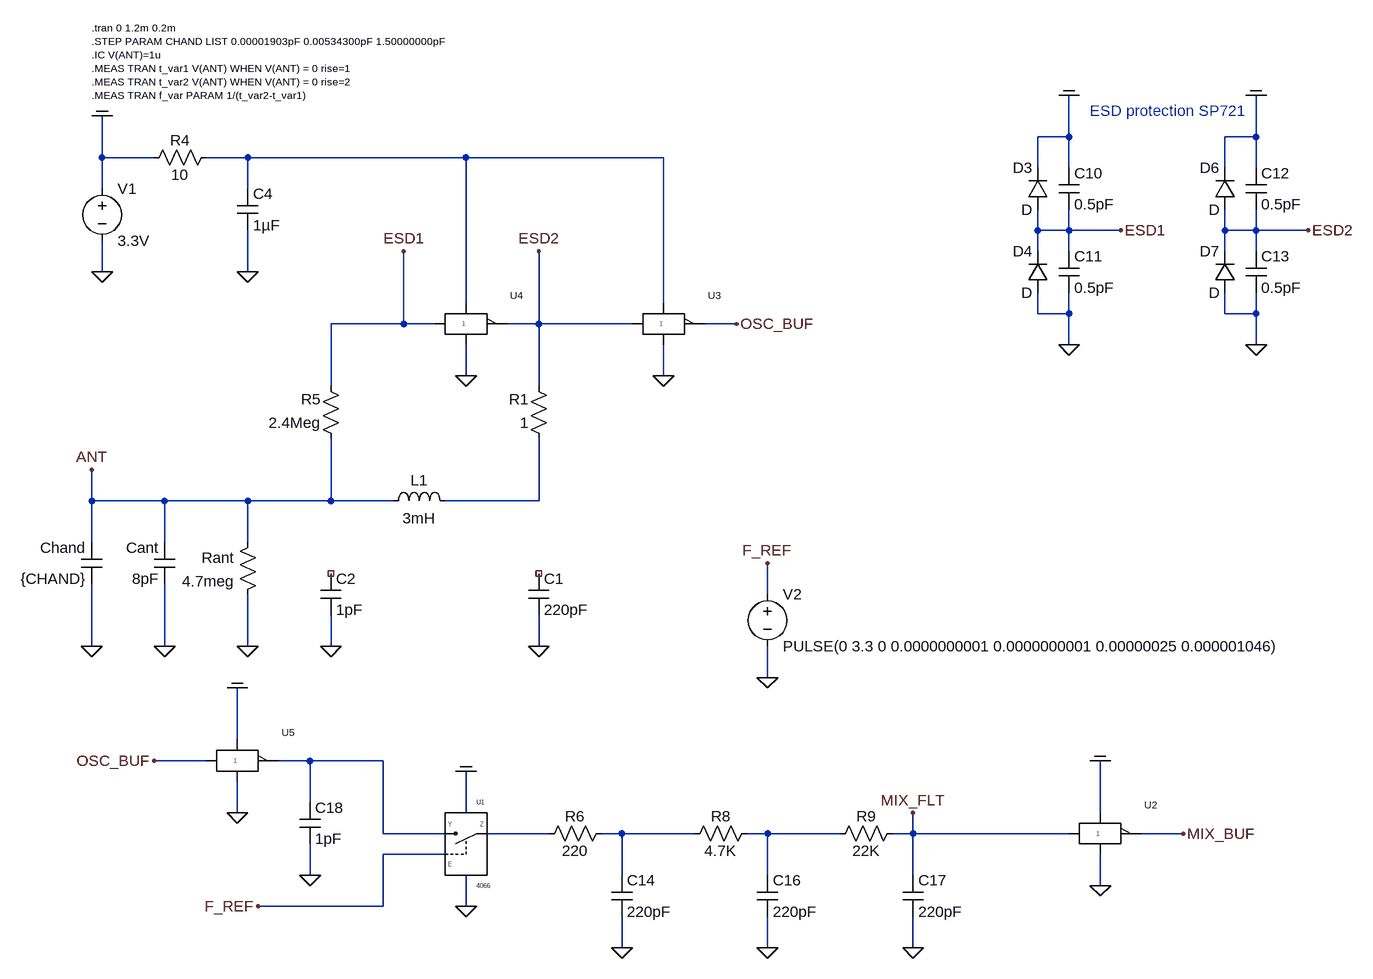
[diagram p0: schematic 2020_analog_oscill_sin_33v_v09_heter.asc]
2020_analog_oscill_sin_33v_v09_heter.asc, the LTspice schematic file:
Version 4
SHEET 1 2908 1572
WIRE 432 -368 432 -432
WIRE 432 -368 384 -368
WIRE 720 -368 720 -432
WIRE 720 -368 672 -368
WIRE -1056 -336 -1056 -400
WIRE -976 -336 -1056 -336
WIRE -832 -336 -896 -336
WIRE -496 -336 -832 -336
WIRE -192 -336 -496 -336
WIRE 384 -320 384 -368
WIRE 432 -320 432 -368
WIRE 672 -320 672 -368
WIRE 720 -320 720 -368
WIRE -1056 -288 -1056 -336
WIRE -832 -288 -832 -336
WIRE 384 -224 384 -256
WIRE 432 -224 432 -256
WIRE 432 -224 384 -224
WIRE 512 -224 432 -224
WIRE 672 -224 672 -256
WIRE 720 -224 720 -256
WIRE 720 -224 672 -224
WIRE 800 -224 720 -224
WIRE 384 -192 384 -224
WIRE 432 -192 432 -224
WIRE 672 -192 672 -224
WIRE 720 -192 720 -224
WIRE -1056 -160 -1056 -208
WIRE -832 -160 -832 -224
WIRE -496 -112 -496 -336
WIRE -192 -112 -192 -336
WIRE 384 -96 384 -128
WIRE 432 -96 432 -128
WIRE 432 -96 384 -96
WIRE 672 -96 672 -128
WIRE 720 -96 720 -128
WIRE 720 -96 672 -96
WIRE -592 -80 -592 -192
WIRE -592 -80 -704 -80
WIRE -544 -80 -592 -80
WIRE -384 -80 -384 -192
WIRE -384 -80 -432 -80
WIRE -240 -80 -384 -80
WIRE -80 -80 -128 -80
WIRE 432 -48 432 -96
WIRE 720 -48 720 -96
WIRE -496 0 -496 -48
WIRE -192 0 -192 -48
WIRE -704 16 -704 -80
WIRE -384 16 -384 -80
WIRE -1072 192 -1072 144
WIRE -960 192 -1072 192
WIRE -832 192 -960 192
WIRE -704 192 -704 96
WIRE -704 192 -832 192
WIRE -608 192 -704 192
WIRE -384 192 -384 96
WIRE -384 192 -528 192
WIRE -1072 256 -1072 192
WIRE -960 256 -960 192
WIRE -832 256 -832 192
WIRE -32 336 -32 288
WIRE -1072 416 -1072 320
WIRE -960 416 -960 320
WIRE -832 416 -832 336
WIRE -704 416 -704 368
WIRE -384 416 -384 368
WIRE -32 464 -32 416
WIRE -848 560 -848 480
WIRE -896 592 -976 592
WIRE -736 592 -784 592
WIRE -624 592 -736 592
WIRE -736 656 -736 592
WIRE -848 672 -848 624
WIRE -496 672 -496 608
WIRE 480 672 480 592
WIRE -624 704 -624 592
WIRE -528 704 -624 704
WIRE -368 704 -464 704
WIRE -256 704 -288 704
WIRE -144 704 -256 704
WIRE -32 704 -64 704
WIRE 80 704 -32 704
WIRE 192 704 192 672
WIRE 192 704 160 704
WIRE 432 704 192 704
WIRE 608 704 544 704
WIRE -528 736 -624 736
WIRE -736 768 -736 720
WIRE -256 768 -256 704
WIRE -32 768 -32 704
WIRE 192 768 192 704
WIRE 480 784 480 736
WIRE -624 816 -624 736
WIRE -624 816 -816 816
WIRE -496 816 -496 768
WIRE -256 880 -256 832
WIRE -32 880 -32 832
WIRE 192 880 192 832
FLAG -1056 -160 0
FLAG -1072 416 0
FLAG -1072 144 ANT
FLAG -832 416 0
FLAG -1056 -400 COM
FLAG 432 -48 0
FLAG 432 -432 COM
FLAG 512 -224 ESD1
FLAG 720 -48 0
FLAG 720 -432 COM
FLAG 800 -224 ESD2
FLAG -960 416 0
FLAG -592 -192 ESD1
FLAG -80 -80 OSC_BUF
FLAG -832 -160 0
FLAG -384 -192 ESD2
FLAG -976 592 OSC_BUF
FLAG -816 816 F_REF
FLAG -496 608 COM
FLAG -496 816 0
FLAG -256 880 0
FLAG -32 880 0
FLAG 192 880 0
FLAG 192 672 MIX_FLT
FLAG -32 464 0
FLAG -32 288 F_REF
FLAG -736 768 0
FLAG 480 592 COM
FLAG 480 784 0
FLAG 608 704 MIX_BUF
FLAG -192 0 0
FLAG -496 0 0
FLAG -384 416 0
FLAG -704 416 0
FLAG -848 480 COM
FLAG -848 672 0
SYMBOL voltage -1056 -304 R0
WINDOW 123 0 0 Left 2
WINDOW 39 0 0 Left 2
SYMATTR InstName V1
SYMATTR Value 3.3V
SYMBOL ind -512 208 M270
WINDOW 0 32 56 VTop 2
WINDOW 3 5 56 VBottom 2
SYMATTR InstName L1
SYMATTR Value 3mH
SYMATTR SpiceLine Ipk=0.1 Rser=101 Rpar=2Meg Cpar=1.286pF
SYMBOL cap -1056 256 M0
SYMATTR InstName Chand
SYMATTR Value {CHAND}
SYMBOL res -816 240 M0
SYMATTR InstName Rant
SYMATTR Value 4.7meg
SYMBOL diode 400 -256 R180
WINDOW 0 24 64 Left 2
WINDOW 3 24 0 Left 2
SYMATTR InstName D3
SYMBOL diode 400 -128 R180
WINDOW 0 24 64 Left 2
WINDOW 3 24 0 Left 2
SYMATTR InstName D4
SYMBOL cap 416 -320 R0
SYMATTR InstName C10
SYMATTR Value 0.5pF
SYMBOL cap 416 -192 R0
SYMATTR InstName C11
SYMATTR Value 0.5pF
SYMBOL diode 688 -256 R180
WINDOW 0 24 64 Left 2
WINDOW 3 24 0 Left 2
SYMATTR InstName D6
SYMBOL diode 688 -128 R180
WINDOW 0 24 64 Left 2
WINDOW 3 24 0 Left 2
SYMATTR InstName D7
SYMBOL cap 704 -320 R0
SYMATTR InstName C12
SYMATTR Value 0.5pF
SYMBOL cap 704 -192 R0
SYMATTR InstName C13
SYMATTR Value 0.5pF
SYMBOL cap -944 256 M0
SYMATTR InstName Cant
SYMATTR Value 8pF
SYMBOL res -880 -352 R90
WINDOW 0 5 56 VBottom 2
WINDOW 3 27 56 VTop 2
SYMATTR InstName R4
SYMATTR Value 10
SYMBOL cap -848 -288 R0
SYMATTR InstName C4
SYMATTR Value 1µF
SYMBOL Dig_Add\\CD4xxx\\cd4066 -496 720 R0
SYMATTR InstName U1
SYMBOL cap -272 768 R0
SYMATTR InstName C14
SYMATTR Value 220pF
SYMBOL res -272 688 R90
WINDOW 0 5 56 VBottom 2
WINDOW 3 27 56 VTop 2
SYMATTR InstName R6
SYMATTR Value 220
SYMBOL cap -48 768 R0
SYMATTR InstName C16
SYMATTR Value 220pF
SYMBOL res -48 688 R90
WINDOW 0 5 56 VBottom 2
WINDOW 3 27 56 VTop 2
SYMATTR InstName R8
SYMATTR Value 4.7K
SYMBOL cap 176 768 R0
SYMATTR InstName C17
SYMATTR Value 220pF
SYMBOL res 176 688 R90
WINDOW 0 5 56 VBottom 2
WINDOW 3 27 56 VTop 2
SYMATTR InstName R9
SYMATTR Value 22K
SYMBOL voltage -32 320 R0
WINDOW 123 0 0 Left 2
WINDOW 39 0 0 Left 2
SYMATTR InstName V2
SYMATTR Value PULSE(0 3.3 0 0.0000000001 0.0000000001 0.00000025 0.000001046)
SYMBOL cap -752 656 R0
SYMATTR InstName C18
SYMATTR Value 1pF
SYMBOL SBORKA\\Logika\\74AHC1G04 480 656 R0
SYMATTR InstName U2
SYMBOL SBORKA\\Logika\\74AHC1G04 -192 -128 R0
SYMATTR InstName U3
SYMBOL SBORKA\\Logika\\74AHC1G04 -496 -128 R0
SYMATTR InstName U4
SYMBOL cap -400 304 R0
SYMATTR InstName C1
SYMATTR Value 220pF
SYMBOL res -688 112 R180
WINDOW 0 31 76 Left 2
WINDOW 3 31 40 Left 2
SYMATTR InstName R5
SYMATTR Value 2.4Meg
SYMBOL res -368 112 R180
WINDOW 0 31 76 Left 2
WINDOW 3 31 40 Left 2
SYMATTR InstName R1
SYMATTR Value 1
SYMBOL cap -720 304 R0
SYMATTR InstName C2
SYMATTR Value 1pF
SYMBOL SBORKA\\Logika\\74AHC1G04 -848 544 R0
SYMATTR InstName U5
TEXT -1072 -536 Left 1 !.tran 0 1.2m 0.2m\n.STEP PARAM CHAND LIST 0.00001903pF 0.00534300pF 1.50000000pF\n.IC V(ANT)=1u\n.MEAS TRAN t_var1 V(ANT) WHEN V(ANT) = 0 rise=1\n.MEAS TRAN t_var2 V(ANT) WHEN V(ANT) = 0 rise=2\n.MEAS TRAN f_var PARAM 1/(t_var2-t_var1)
TEXT 464 -408 Left 2 ;ESD protection SP721

The netlist it stands for:
* 2020_analog_oscill_sin_33v_v09_heter.asc
V1 COM 0 3.3V
L1 N002 ANT 3mH Ipk=0.1 Rser=101 Rpar=2Meg Cpar=1.286pF
Chand ANT 0 {CHAND}
Rant ANT 0 4.7meg
D3 ESD1 COM D
D4 0 ESD1 D
C10 COM ESD1 0.5pF
C11 ESD1 0 0.5pF
D6 ESD2 COM D
D7 0 ESD2 D
C12 COM ESD2 0.5pF
C13 ESD2 0 0.5pF
Cant ANT 0 8pF
R4 N001 COM 10
C4 N001 0 1µF
XU1 N003 N004 F_REF COM 0 4066  ; pins Y OUT EN VCC VSS
C14 N005 0 220pF
R6 N005 N004 220
C16 N006 0 220pF
R8 N006 N005 4.7K
C17 MIX_FLT 0 220pF
R9 MIX_FLT N006 22K
V2 F_REF 0 PULSE(0 3.3 0 0.0000000001 0.0000000001 0.00000025 0.000001046)
C18 N003 0 1pF
XU2 MIX_FLT MIX_BUF COM 0 74AHC1G04  ; pins in out vcc gnd
XU3 ESD2 OSC_BUF N001 0 74AHC1G04  ; pins in out vcc gnd
XU4 ESD1 ESD2 N001 0 74AHC1G04  ; pins in out vcc gnd
C1 NC_01 0 220pF
R5 ANT ESD1 2.4Meg
R1 N002 ESD2 1
C2 NC_02 0 1pF
XU5 OSC_BUF N003 COM 0 74AHC1G04  ; pins in out vcc gnd
.model D D
.lib standard.dio
.tran 0 1.2m 0.2m
.STEP PARAM CHAND LIST 0.00001903pF 0.00534300pF 1.50000000pF
.IC V(ANT)=1u
.MEAS TRAN t_var1 V(ANT) WHEN V(ANT) = 0 rise=1
.MEAS TRAN t_var2 V(ANT) WHEN V(ANT) = 0 rise=2
.MEAS TRAN f_var PARAM 1/(t_var2-t_var1)
* ESD protection SP721
.lib SwitchAna.lib
.lib 74AHC1G04.cir
.backanno
.end